# Altium schematic sheet SourceOptode.SchDoc: Optode Source Emitter
size A4; CompanyName: UofT Capstone Team 2024991; Revision: 1; SheetNumber: 1; SheetTotal: 1
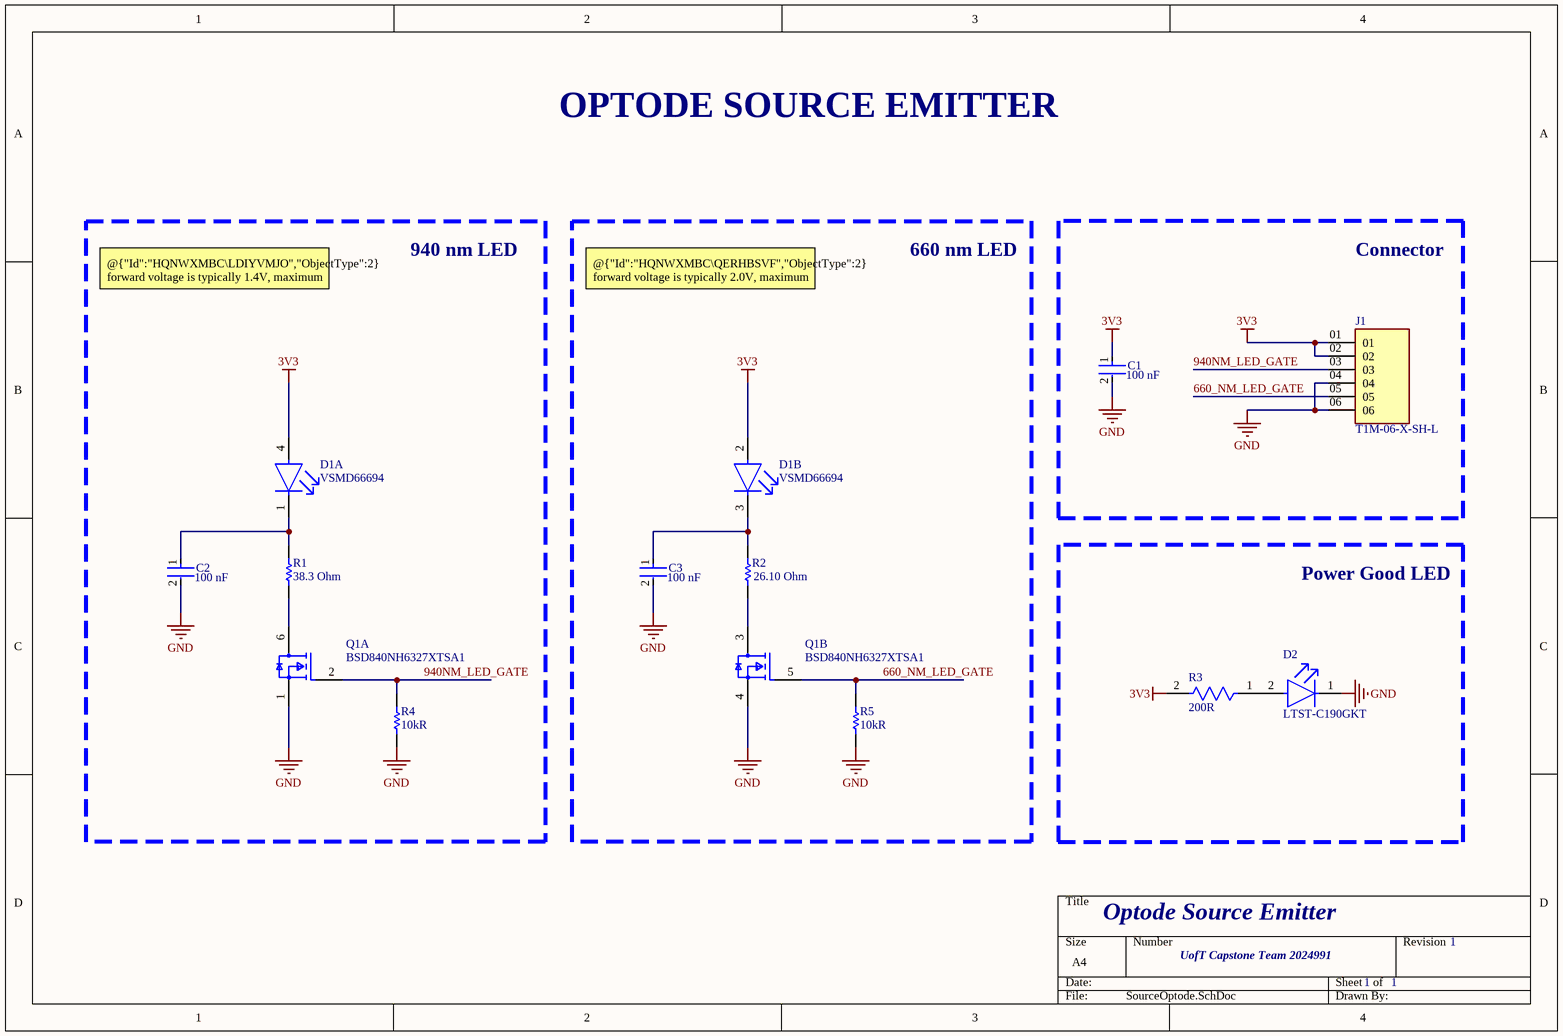
[diagram p0: SourceOptode.SchDoc]

## Parts
C1  Capacitance: 100 nF  [FP-CC0603-DA-MFG]  (hidden comment: CC0603KRX7R7BB104)
C2  Capacitance: 100 nF  [FP-CC0603-DA-MFG]  (hidden comment: CC0603KRX7R7BB104)
C3  Capacitance: 100 nF  [FP-CC0603-DA-MFG]  (hidden comment: CC0603KRX7R7BB104)
D1  VSMD66694  [FP-6_550-5347_01-4-MFG]  (parts A,B of 2)
D2  LTST-C190GKT  [FP-LTST-C190GKT-MFG]
J1  T1M-06-X-SH-L  [SAMTEC_T1M-06-X-SH-L]
Q1  BSD840NH6327XTSA1  [FP-PG-SOT363-6-MFG]  (parts A,B of 2)
R1  Resistance: 38.3 Ohm  [RESC1608X55X30LL20T10]  (hidden comment: RK73H1JTTD38R3F)
R2  value 26.10 Ohm  [RESC0603(1608)_L]  (hidden comment: 26R1 1% 0603(1608))
R3  Resistance: 200R  [FP-CRCW0603-e3-MFG]  (hidden comment: CRCW0603200RFKEA)
R4  Resistance: 10kR  [RESC1609X50X30NL8T20]  (hidden comment: CRCW060310K0FKEA)
R5  Resistance: 10kR  [RESC1609X50X30NL8T20]  (hidden comment: CRCW060310K0FKEA)

## Blocks framed on the sheet
940 nm LED: C2 D1 Q1 R1 R4
660 nm LED: C3 D1 Q1 R2 R5
Connector: C1 J1
Power Good LED: D2 R3

## Nets
3V3: C1.1 D1.2(RED_A) D1.4(IR_anode) J1.01 J1.02 R3.2
GND: C1.2 C2.2 C3.2 D2.1(C) J1.04 J1.06 Q1.1(1_SOURCE) Q1.4(2_SOURCE) R4.1 R5.1
660_NM_LED_GATE: J1.05 Q1.5(2_GATE) R5.2
940NM_LED_GATE: J1.03 Q1.2(1_GATE) R4.2
NetC2_1: C2.1 D1.1(IR_cathode) R1.2
NetC3_1: C3.1 D1.3(RED_C) R2.2
NetD2_2: D2.2(A) R3.1
NetQ1_3: Q1.3(2_DRAIN) R2.1
NetQ1_6: Q1.6(1_DRAIN) R1.1

## Notes on the sheet
- OPTODE SOURCE EMITTER
- @{"Id":"HQNWXMBC\LDIYVMJO","ObjectType":2} forward voltage is typically 1.4V, maximum current is 50mA
- @{"Id":"HQNWXMBC\QERHBSVF","ObjectType":2} forward voltage is typically 2.0V, maximum current is 50mA

## Library data of the parts
C1-C3 = CMP-2000-05002-2: CAP CER 0.1UF 16V X7R 0603; Manufacturer: YAGEO; Tolerance: 0.1; Value: 100 nF; Temperature Coefficient: 15%; Material: Ceramic; Voltage Rating: 16 V; Package: CC0603-DA; ComponentLink2Description: Datasheet; Octopart: https://octopart.com/cc0603krx7r7bb104-yageo-192941; Temperature Range High: +125°C; Digikey Description: CAP CER 0.1UF 16V X7R 0603; Voltage: 16 V; Device Class L2: Capacitors; Height: 0.9mm; Temperature: -55°C to +125°C; Manufacturer Part Number: CC0603KRX7R7BB104; Device Class L1: Passive Components; Device Class L3: Ceramic Capacitors; ComponentLink2URL: http://www.yageo.com/documents/recent/UPY-GPHC_X7R_6.3V-to-50V_18.pdf; Footprint Url: http://www.yageo.com/exep/pages/download/literatures/UPY-C_GEN_24.pdf; RoHS: TRUE; Temperature Range Low: -55°C; Temperature Characteristic: X7R; Lead Free: Yes; Category: Cap; Mouser Description: Multilayer Ceramic Capacitor, CC Series, 0.1 - F, - 10%, X7R, 16 V, 0603 [1608 Metric]; Automotive: No
D1 = CMP-02520-000014-1: EMITTER DUAL 660/940NM SQURE PCB; Manufacturer: Vishay Semiconductor Opto Division; Forward Voltage: 2/1.4V; Viewing Angle: 120°; Colour: Red,IR; Led Orientation: Top View; Forward Current: 20mA; Power Dissipation: 161/119mW; Reverse Voltage: 5V; Max Junction Temp: +100°C; Digikey Description: EMITTER DUAL 660/940NM SQURE PCB; ComponentLink2Description: Datasheet; Temperature Range Low: -25°C; Package: 6.550-5347.01-4; Ambient Temperature Range Low: -25°C; Category: Diode; Temperature: -25°C to +85°C; Device Class L3: unset; Ambient Temperature Range High: +85°C; Temperature Range High: +85°C; Automotive: No; Height: 0.97mm; Lead Free: Yes; Peak Emmision Wavelength: 660/940nm; Device Class L2: LEDs; RoHS: TRUE; Octopart: https://octopart.com/vsmd66694-vishay-74221794; Manufacturer Part Number: VSMD66694; Device Class L1: Optoelectronics; ComponentLink2URL: https://www.vishay.com/docs/84324/vsmd66694.pdf
D2 = CMP-22017-000005-2: LED GREEN CLEAR CHIP SMD; Dominant Wavelength: 569nm; Reverse Voltage: 5V; Lens Color: Colorless; Viewing Angle: 130°; Voltage: 2V; Forward Current: 30mA; Power Dissipation: 100mW; Luminous Intensity: 6mcd; Number of LEDs: 1; Forward Voltage: 2.1V; Wavelength: 565nm; Test Current: 10mA; Min Operating Temperature: -55°C; Lens Style: Clear; Mount: Surface Mount; Width: 0.8mm; Packaging: Tape and Reel; Lens Transparency: Clear; Case Code (Metric): 1608; Depth: 0.8mm; Case Code (Imperial): 0603; Case/Package: 0603; Number of Pins: 2; Max Operating Temperature: 85°C; Lead Free: Lead Free; Number of Elements: 1; Length: 1.6mm; Height: 0.8mm; Package Quantity: 1; Power Rating: 100mW; Radiation Hardening: No; Illumination Color: Green; Color: Green
J1 = T1M-06-X-SH-L: Connector Header Surface Mount, Right Angle 6 position 0.039" (1.00mm); MF: Samtec; Availability: Unavailable; Value: *; Price: None; MP: T1M-06-X-SH-L; Package: None
Q1 = CMP-32901-000170-1: MOSFET 2N-CH 20V 0.88A SOT363; Input Capacitance: 78pF; Rds On Max: 400mR; Max Power Dissipation: 500mW; Rise Time: 2.2ns; FET Type: 2 N-Channel; Continuous Drain Current (ID): 880mA; Gate to Source Voltage (Vgs): 8V; Halogen Free: Halogen Free; Case/Package: SOT-363-6; Mount: Surface Mount; Packaging: Tape and Reel; Lead Free: Lead Free; Max Operating Temperature: 150°C; Number of Pins: 6; Max Dual Supply Voltage: 20V; Drain to Source Voltage (Vdss): 20V; Min Operating Temperature: -55°C
R1 = CMP-2000-01468-1: Manufacturer: KOA Speer; Part Number: RK73H1JTTD38R3F
R2 = CMP-1012-00329-1: 26R1 0.1W 1% 0603 (1608 Metric)  SMD; Case-Metric: 1608; Case-EIA: 0603; Power: 0.1 W; Tolerance: 1 %; Technology: SMT
R3 = CMP-2000-03062-2: RES Thick Film, 200Ω, 1%, 0.1W, 100ppm/°C, 0603; Power Rating: 100mW; Voltage Rating (DC): 75V; Military Standard: Not; Tolerance: 1%; Lead Free: Lead Free; Case Code (Imperial): 0603; Depth: 0.85mm; Max Operating Temperature: 155°C; Contact Plating: Tin; Length: 1.55mm; Weight: 7.1E-05oz; Voltage Rating: 75V; Height: 0.45mm; Min Operating Temperature: -55°C; Case/Package: 0603; Number of Pins: 2; Composition: Thick Film; Termination: SMD/SMT; Case Code (Metric): 1608; Width: 0.85mm; Package Quantity: 5000; Temperature Coefficient: 100ppm/°C; Packaging: Tape and Reel
R4 R5 = CMP-1666-00005-4: Chip Resistor, 10 KOhm, +/- 1%, 100 mW, -55 to 155 degC, 0603 (1608 Metric), RoHS, Tape and Reel; Manufacturer: Vishay Semiconductor; Voltage Rating: 75 V; Max Operating Temperature: 155 degC; PackageDescription: 2-Pin Surface Mount Device, Body 1.575 x 0.85 mm; ComponentLink1Description: Manufacturer URL; RoHSCompliant: true; PackageReference: 0603; REACH SVHC: Unknown; Length: 1.55 mm; DatasheetVersion: 06/2012; Packaging: Tape and Reel; Min Operating Temperature: -55 degC; Mounting Technology: Surface Mount; ComponentLink2URL: https://datasheet.ciiva.com/11809/0900766b80d98afc-11809037.pdf; Height: 0.45 mm; ComponentLink2Description: Datasheet; Package Quantity: 5000; ComponentLink1URL: http://www.vishay.com/